# Altium schematic sheet MCU.SchDoc
size A; SheetNumber: 1; SheetTotal: 2
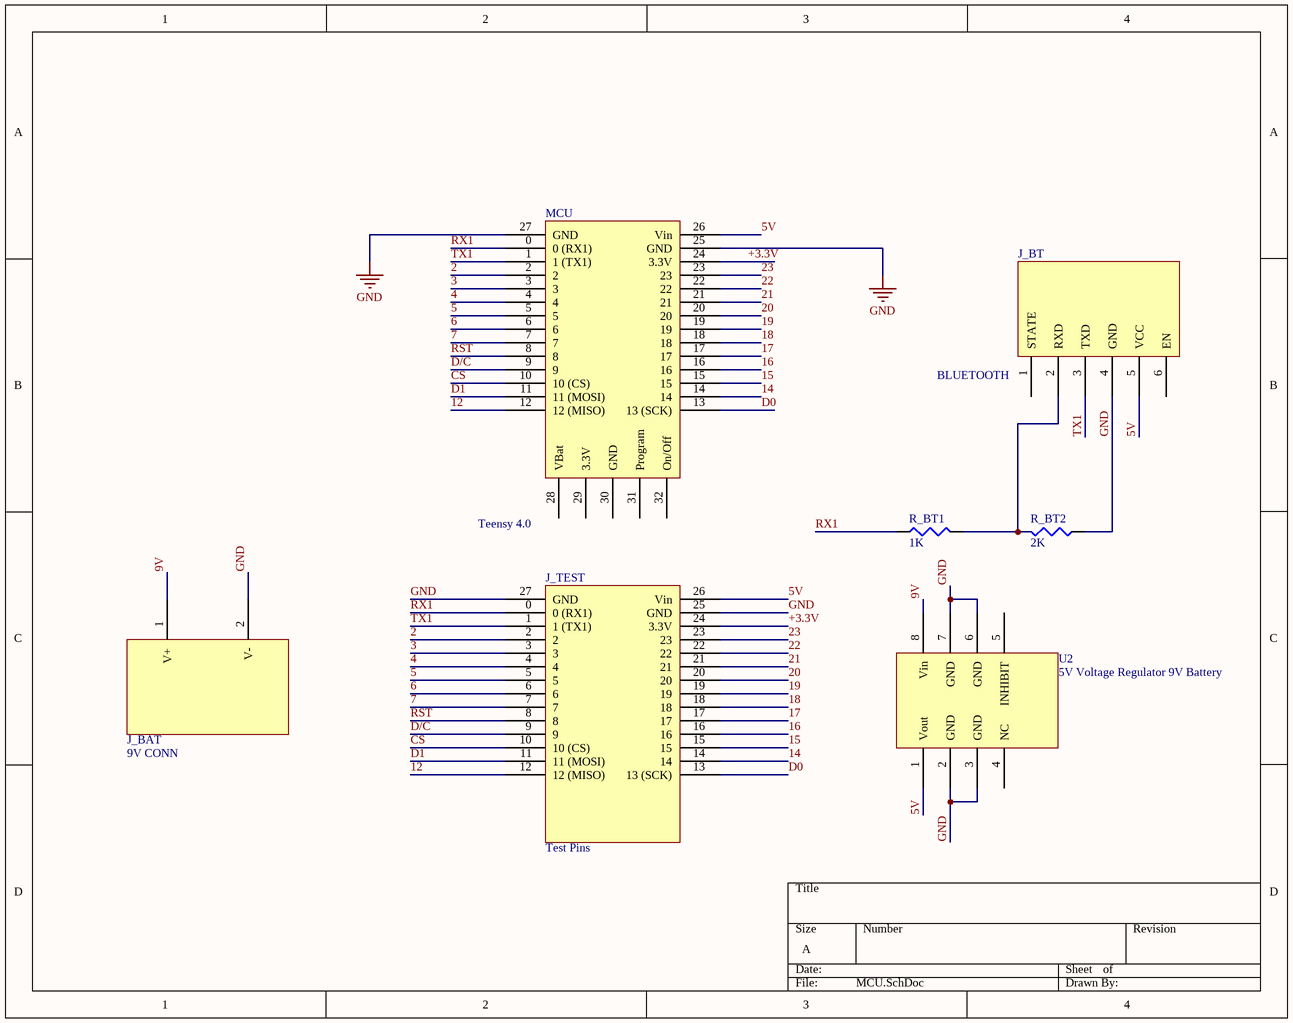
[diagram p0: MCU.SchDoc]

## Parts
J_BAT  9V CONN  [2POS_TERMINAL]
J_BT  BLUETOOTH  [HC05]
J_TEST  Test Pins  [TESTPINS]
MCU  Teensy 4.0  [TEENSY 4.0]
R_BT1  1K  [SMD-0805]
R_BT2  2K  [SMD-0805]
U2  5V Voltage Regulator 9V Battery  [U2_SO-8]

## Nets
GND: J_BAT.2(V-) J_BT.4(GND) J_TEST.25(GND) J_TEST.27(GND) MCU.25(GND) MCU.27(GND) R_BT2.1 U2.2(GND) U2.3(GND) U2.6(GND) U2.7(GND)
2: J_TEST.2 MCU.2
3: J_TEST.3 MCU.3
4: J_TEST.4 MCU.4
5: J_TEST.5 MCU.5
5V: J_BT.5(VCC) J_TEST.26(Vin) MCU.26(Vin) U2.1(Vout)
6: J_TEST.6 MCU.6
7: J_TEST.7 MCU.7
9V: J_BAT.1(V+) U2.8(Vin)
12: J_TEST.12(12_(MISO)) MCU.12(12_(MISO))
14: J_TEST.14 MCU.14
15: J_TEST.15 MCU.15
16: J_TEST.16 MCU.16
17: J_TEST.17 MCU.17
18: J_TEST.18 MCU.18
19: J_TEST.19 MCU.19
20: J_TEST.20 MCU.20
21: J_TEST.21 MCU.21
22: J_TEST.22 MCU.22
23: J_TEST.23 MCU.23
+3.3V: J_TEST.24(3.3V) MCU.24(3.3V)
~{CS}: J_TEST.10(10_(CS)) MCU.10(10_(CS))
D0: J_TEST.13(13_(SCK)) MCU.13(13_(SCK))
D1: J_TEST.11(11_(MOSI)) MCU.11(11_(MOSI))
D/~{C}: J_TEST.9 MCU.9
~{RST}: J_TEST.8 MCU.8
RX1: J_TEST.0(0_(RX1)) MCU.0(0_(RX1)) R_BT1.1
TX1: J_BT.3(TXD) J_TEST.1(1_(TX1)) MCU.1(1_(TX1))
NetJ_BT_2: J_BT.2(RXD) R_BT1.2 R_BT2.2

Not connected (* = marked no-connect by the designer): J_BT 1(STATE) 6(EN); MCU 28(VBat) 29(3.3V) 30(GND) 31(Program) 32(On/Off); U2 4(NC) 5(INHIBIT)

## Library data of the parts
J_BAT = Battery Connector
J_BT = HC05
R_BT1 R_BT2 = Resistor